# Altium schematic sheet CurrentSense.SchDoc
size A; SheetNumber: 6; SheetTotal: 14
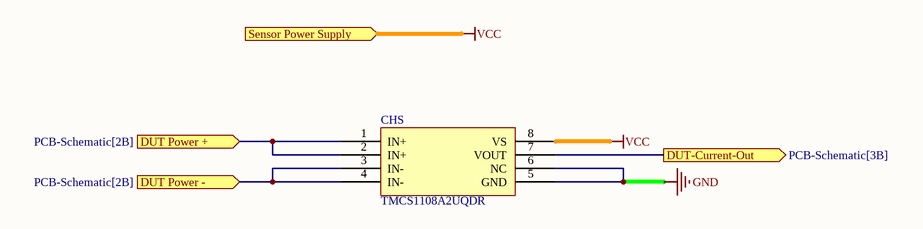
[diagram p0: CurrentSense.SchDoc]

## Parts
CHS  TMCS1108A2UQDR  [TMCS1108]

## Ports
DUT Power + (in, see PCB-Schematic[2B]), DUT Power - (in, see PCB-Schematic[2B]), DUT-Current-Out (out, see PCB-Schematic[3B]), Sensor Power Supply (in, see PCB-Schematic[2B], ADC[2B], Thermistor[1A], VRB[2B])

## Nets
GND: CHS.5(GND) CHS.6(NC)
VCC: CHS.8(VS) ; port Sensor Power Supply
DUT Power +: CHS.1(IN+) CHS.2(IN+) ; port DUT Power +
DUT Power -: CHS.3(IN-) CHS.4(IN-) ; port DUT Power -
DUT-Current-Out: CHS.7(VOUT) ; port DUT-Current-Out